# Altium schematic sheet Power.SchDoc
size A4; SheetNumber: 3; SheetTotal: 3
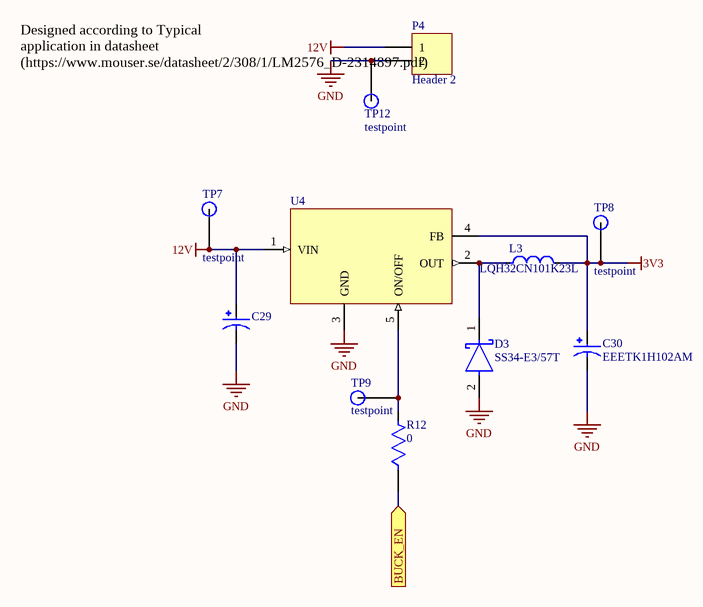
[diagram p0: Power.SchDoc]

## Parts
C29  EEETC1C101P  [CAP_EEETC1C101P]  (value not drawn)
C30  EEETK1H102AM  [CAP_EEETK1H102AM]
D3  SS34-E3/57T  [FP-95402-MFG]
L3  LQH32CN101K23L  [FP-LQH32CH_23-MFG]
P4  Header 2  [HDR1X2]
R12  0  [FP-AC0603-MFG]
TP7  testpoint  [Testpoint]
TP8  testpoint  [Testpoint]
TP9  testpoint  [Testpoint]
TP12  testpoint  [Testpoint]
U4  LM2576D2TR4-3.3G  [D2PAK-5]  (value not drawn)

## Ports
BUCK_EN (in)

## Nets
3V3: C30.1 L3.2 TP8.1(tp) U4.4(FB)
12V: C29.1 P4.1 TP7.1(tp) U4.1(VIN)
GND: C29.2 C30.2 D3.2(A) P4.2 TP12.1(tp) U4.3(GND)
BUCK_EN: R12.1 ; port BUCK_EN
NetD3_1: D3.1(C) L3.1 U4.2(OUT)
NetR12_2: R12.2 TP9.1(tp) U4.5(ON/OFF)

## Notes on the sheet
- Designed according to Typical application in datasheet (https://www.mouser.se/datasheet/2/308/1/LM2576_D-2314897.pdf)

## Library data of the parts
C29 = EEETC1C101P: 100µF 16V Aluminum Electrolytic Capacitors Radial, Can - SMD 200mOhm @ 100kHz 3000 Hrs @ 125°C; MF: Panasonic; MP: EEETC1C101P; Package: RADIAL-2 Panasonic; Availability: In Stock; Value: *; SnapEDA_Link: https://www.snapeda.com/parts/EEETC1C101P/Panasonic/view-part/?ref=snap; Price: None; Check_prices: https://www.snapeda.com/parts/EEETC1C101P/Panasonic/view-part/?ref=eda
C30 = EEETK1H102AM: 1000µF 50V Aluminum Electrolytic Capacitors Radial, Can - SMD 140mOhm @ 100kHz 2000 Hrs @ 125°C; MF: Panasonic Electronic; MP: EEE-TK1H102AM; Availability: In Stock; Price: None; Package: RADIAL-2 Panasonic; SnapEDA_Link: https://www.snapeda.com/parts/EEE-TK1H102AM/Panasonic%20Electronic%20Components/view-part/2193516/?ref=snap; Value: *; Check_prices: https://www.snapeda.com/parts/EEE-TK1H102AM/Panasonic%20Electronic%20Components/view-part/2193516/?ref=eda; Purchase-URL: https://pricing.snapeda.com/search/part/EEE-TK1H102AM/?ref=eda
D3 = CMP-02539-000012-1: DIODE SCHOTTKY 40V 3A DO214AB; Manufacturer: Vishay; Max Junction Temp: +150°C; Peak Reverse Current: 0.5mA; Max Surge Forward Current: 100A; Standoff Height: 0mm; ComponentLink2Description: Datasheet; Device Class L3: Schottky Diodes; Height: 2.62mm; Max Repetitive Reverse Voltage: 40V; Lead Free: Yes; Package: 95402; Temperature Range High: +150°C; ComponentLink2URL: http://www.vishay.com/docs/88751/ss32.pdf; Temperature: -55°C to +150°C; Footprint Url: http://www.vishay.com/docs/95402/smc.pdf; Automotive: No; Forward Current: 3A; Category: Diode; Manufacturer Part Number: SS34-E3/57T; RoHS: TRUE; Device Class L2: Diodes; Mouser Description: Schottky Diodes & Rectifiers 3.0 Amp 40 Volt; Octopart: https://octopart.com/ss34-e3%2F57t-vishay-39552907; Temperature Range Low: -55°C; Device Class L1: Discrete Semiconductors; Digikey Description: DIODE SCHOTTKY 40V 3A DO214AB
L3 = CMP-06042-006648-2: Wire Wound Ferrite Inductor for Power Lines 100μH ±10% 4.55Ω 100mA 1210; Q Factor: 40; Current: 1.1A; Self Resonant Frequency: 10MHz; Shielding: Unshielded; DC Resistance (DCR): 3.5R; Test Frequency: 1MHz; Inductance: 100uH; Case Code (Imperial): 1210; Lead Free: Lead Free; Military Standard: Not; Mount: Surface Mount; REACH SVHC: No SVHC; Max Operating Temperature: 85°C; DC Current: 100mA; Weight: 0.002116oz; Radiation Hardening: No; Inductance Tolerance: 10%; Number of Pins: 2; Packaging: Tape and Reel; Rated Current-Max: 100mA; Termination: SMD/SMT; Max DC Current: 100mA; Current Rating: 100mA; Width: 2.5mm; Height: 2mm; Core Material: Ferrite; RoHS Compliant: Yes; Frequency: 10MHz; Package Quantity: 2000; Series: LQH32C_33; Case/Package: 1210; Length: 3.2mm; Tolerance: 10%; Min Operating Temperature: -40°C; Case Code (Metric): 3225; Depth: 2.7mm; Inductor Type: Wirewound
P4 = Header 2: Header, 2-Pin; LatestRevisionDate: 17-Jul-2002; LatestRevisionNote: Re-released for DXP Platform.; Publisher: Altium Limited
R12 = CMP-03412-025180-1: RES SMD 60.4 OHM 1% 1/10W 0603; Manufacturer Part Number: AC0603FR-0760R4L; Manufacturer: Yageo; Automotive Grade: Grade 0; Value: 60.4Ω; Power Rating: 0.1W; Voltage Rating: 75V; Tolerance: 0.01; Automotive: Yes; Category: Res; Mouser Description: Res Thick Film 0603 60.4 Ohm 1% 0.1W(1/10W) ±100ppm/C Epoxy Pad SMD Automotive T/R; Height: 0.55mm; Temperature: -55°C to +155°C; Resistance: 60.4Ω; Package: AC0603; Device Class L3: Chip SMD Resistors; ComponentLink2URL: http://www.yageo.com/NewPortal/yageodocoutput?fileName=/pdf/R-Chip/PYu-AC_51_RoHS_L_6.pdf; Composition: Thick Film; Octopart: https://octopart.com/ac0603fr-0760r4l-yageo-71367350; Temperature Range Low: -55°C; Lead Free: Yes; Footprint Url: http://www.yageo.com/exep/pages/download/literatures/PYu-R_Mount_9.pdf; ComponentLink2Description: Datasheet; Series: AC; Device Class L1: Passive Components; Device Class L2: Resistors; Temperature Range High: +155°C; RoHS: TRUE; Digikey Description: RES SMD 60.4 OHM 1% 1/10W 0603; Ipc Land Pattern Name: RESC16080X45
U4 = LM2576D2TR4-3.3G: http://octopart.com/lm2576d2tr4-5g-on+semiconductor-46514222; Package: None; Price: None; Value: *; MP: LM2576D2TR4-3.3G; Availability: Unavailable